# EAGLE design MAIN_BOT_P (EAGLE 9.4.2)
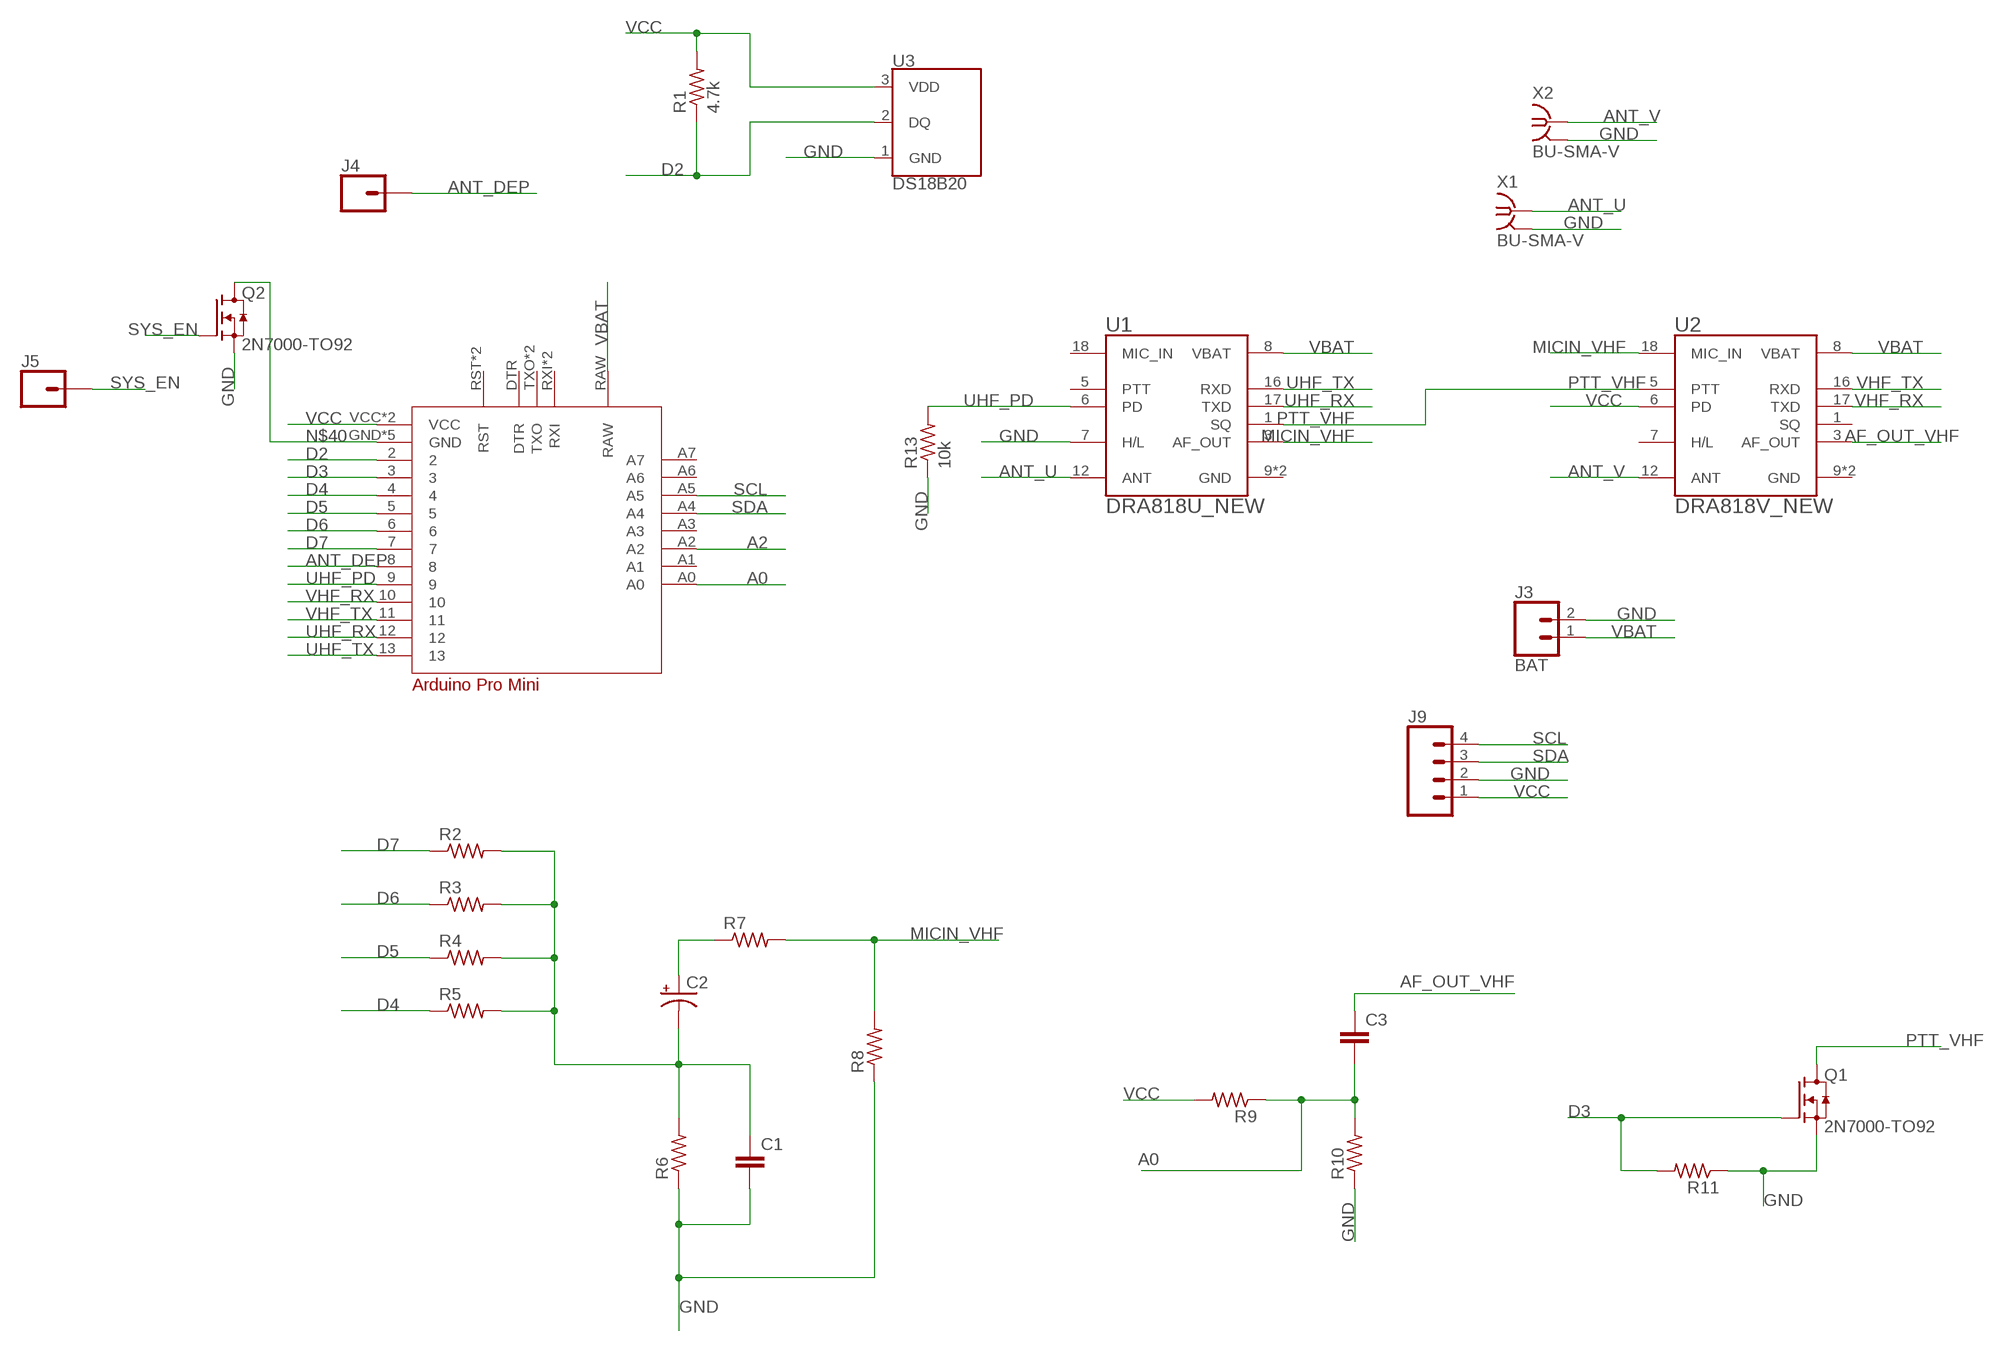
[diagram p0: schematic, sheet 1]

## Parts
C1  C-EU025-024X044  [C025-024X044]
C2  CPOL-USE1.8-4  [E1,8-4]
C3  C-EU025-024X044  [C025-024X044]
J3  BAT  CONN_02  [1X02]
J4  CONN_01  [1X01]
J5  CONN_01  [1X01]
J9  CONN_04PTH  [1X04]
Q1  2N7000-TO92  [TO92]
Q2  2N7000-TO92  [TO92]
R1  4.7k  R-US_0204/5  [0204/5]
R2  R-US_0204/5  [0204/5]
R3  R-US_0204/5  [0204/5]
R4  R-US_0204/5  [0204/5]
R5  R-US_0204/5  [0204/5]
R6  R-US_0204/5  [0204/5]
R7  R-US_0204/5  [0204/5]
R8  R-US_0204/5  [0204/5]
R9  R-US_0204/5  [0204/5]
R10  R-US_0204/5  [0204/5]
R11  R-US_0204/5  [0204/5]
R13  10k  R-US_0204/5  [0204/5]
U1  DRA818U_NEW  [DORJI_DRA818U_NEW]
U2  DRA818V_NEW  [DORJI_DRA818V_NEW]
U3  DS18B20  [TO-92-AMMO]
U$1  ARDUNIO_PRO_MINI  [ARDUINOPROMINI]
X1  BU-SMA-V  [BU-SMA-V]
X2  BU-SMA-V  [BU-SMA-V]

## Nets
A0: C3.2 R9.1 R10.2 U$1.A0
A2: U$1.A2
AF_OUT_VHF: C3.1 U2.3(AF_OUT)
ANT_DEP: J4.1 U$1.8
ANT_U: U1.12(ANT) X1.1
ANT_V: U2.12(ANT) X2.1
D2: R1.1 U3.2(DQ) U$1.2
D3: Q1.2(G) R11.2 U$1.3
D4: R5.1 U$1.4
D5: R4.1 U$1.5
D6: R3.1 U$1.6
D7: R2.1 U$1.7
GND: C1.2 J3.2 J9.2 Q1.3(S) Q2.3(S) R6.1 R8.1 R10.1 R11.1 R13.1 U1.7(H/L) U3.1(GND) X1.2 X1.3 X1.4 X1.5 X2.2 X2.3 X2.4 X2.5
MICIN_VHF: R7.2 R8.2 U1.3(AF_OUT) U2.18(MIC_IN)
N$2: C2.+ R7.1
N$3: C1.1 C2.- R2.2 R3.2 R4.2 R5.2 R6.2
N$40: Q2.1(D) U$1.GND U$1.GND2(GND) U$1.GND3(GND) U$1.GND4(GND) U$1.GND5(GND)
PTT_VHF: Q1.1(D) U1.1(SQ) U2.5(PTT)
SCL: J9.4 U$1.A5
SDA: J9.3 U$1.A4
SYS_EN: J5.1 Q2.2(G)
UHF_PD: R13.2 U1.6(PD) U$1.9
UHF_RX: U1.17(TXD) U$1.12
UHF_TX: U1.16(RXD) U$1.13
VBAT: J3.1 U1.8(VBAT) U2.8(VBAT) U$1.RAW
VCC: J9.1 R1.2 R9.2 U2.6(PD) U3.3(VDD) U$1.VCC U$1.VCC1(VCC)
VHF_RX: U2.17(TXD) U$1.10
VHF_TX: U2.16(RXD) U$1.11
Unconnected: U1.5(PTT) U1.18(MIC_IN) U2.1(SQ) U2.7(H/L) U$1.A1 U$1.A3 U$1.A6 U$1.A7 U$1.DTR U$1.RST U$1.RST1(RST) U$1.RXI U$1.RXI1(RXI) U$1.TXO U$1.TXO1(TXO)

## Power pins joined to a net without a drawn wire
GND: U1.9(GND) U1.10(GND) U2.9(GND) U2.10(GND)

## Library data of the parts
C1 C3 = rcl:C-EU: CAPACITOR, European symbol; SPICEPREFIX: C
C2 = rcl:CPOL-US: POLARIZED CAPACITOR, American symbol; SPICEPREFIX: C
J3 = SparkFun-Connectors:CONN_02: Multi connection point. Often used as Generic Header-pin footprint for 0.1 inch spaced/style header connections On any of the 0.1 inch spaced packages, you can populate with these: Break Away Headers - Straight <https://www.sparkfun.com/products/116> (PRT-00116) Break Away Male Headers - Right Angle <https://www.sparkfun.com/products/553> (PRT-00553) Female Headers <https://www.sparkfun.com/products/115> (PRT-00115) Break Away Headers - Machine Pin <https://www.sparkfun.com/products/117> (PRT-00117) Break Away Female Headers - Swiss Machine Pin <https://www.sparkfun.com/products/743> (PRT-00743) For SCREWTERMINALS and SPRING TERMINALS visit here: Screw Terimnals on SparkFun.com <https://www.sparkfun.com/search/results?term=Screw+Terminals> (5mm/3.5mm/2.54mm spacing) This device is also useful as a general connection point to wire up your design to another part of your project. Our various solder wires solder well into these plated through hole pads. Hook-Up Wire - Assortment (Stranded, 22 AWG) <https://www.sparkfun.com/products/11375> (PRT-11375) Hook-Up Wire - Assortment (Solid Core, 22 AWG) <https://www.sparkfun.com/products/11367> (PRT-11367) View the entire wire category on our website here <https://www.sparkfun.com/categories/141> Special notes: Molex polarized connector foot print use with: PRT-08233 with associated crimp pins and housings. 2.54_SCREWTERM for use with PRT-10571. 3.5mm Screw Terminal footprints for PRT-08084 5mm Screw Terminal footprints for use with PRT-08432
J4 J5 = SparkFun-Connectors:CONN_01: Single connection point. Often used as Generic Header-pin footprint for 0.1 inch spaced/style header connections On any of the 0.1 inch spaced packages, you can populate with these: Break Away Headers - Straight <https://www.sparkfun.com/products/116> (PRT-00116) Break Away Male Headers - Right Angle <https://www.sparkfun.com/products/553> (PRT-00553) Female Headers <https://www.sparkfun.com/products/115> (PRT-00115) Break Away Headers - Machine Pin <https://www.sparkfun.com/products/117> (PRT-00117) Break Away Female Headers - Swiss Machine Pin <https://www.sparkfun.com/products/743> (PRT-00743) This device is also useful as a general connection point to wire up your design to another part of your project. Our various solder wires solder well into these plated through hole pads. Hook-Up Wire - Assortment (Stranded, 22 AWG) <https://www.sparkfun.com/products/11375> (PRT-11375) Hook-Up Wire - Assortment (Solid Core, 22 AWG) <https://www.sparkfun.com/products/11367> (PRT-11367) View the entire wire category on our website here <https://www.sparkfun.com/categories/141> Special notes: SMTSO-256-ET is a "flush mount" nut for a 4-40 screw. We mostly use this on specialty testbeds; it is a nice way to connect hardware to your PCB at an adjustable hieght. Also note, the SNAP packages are for using a snappable style connector. We sell a baggie of snaps and they are also used on two LilyPad designs: Snap Assortment - 30 pack (male and female) <https://www.sparkfun.com/products/11347> (DEV-11347) LilyPad Arduino SimpleSnap <https://www.sparkfun.com/products/10941> (DEV-10941) LilyPad SimpleSnap Protoboard <https://www.sparkfun.com/products/10940> (DEV-10940)
J9 = SparkFun-Connectors:CONN_04: Multi connection point. Often used as Generic Header-pin footprint for 0.1 inch spaced/style header connections On any of the 0.1 inch spaced packages, you can populate with these: Break Away Headers - Straight <https://www.sparkfun.com/products/116> (PRT-00116) Break Away Male Headers - Right Angle <https://www.sparkfun.com/products/553> (PRT-00553) Female Headers <https://www.sparkfun.com/products/115> (PRT-00115) Break Away Headers - Machine Pin <https://www.sparkfun.com/products/117> (PRT-00117) Break Away Female Headers - Swiss Machine Pin <https://www.sparkfun.com/products/743> (PRT-00743) For SCREWTERMINALS and SPRING TERMINALS visit here: Screw Terimnals on SparkFun.com <https://www.sparkfun.com/search/results?term=Screw+Terminals> (5mm/3.5mm/2.54mm spacing) This device is also useful as a general connection point to wire up your design to another part of your project. Our various solder wires solder well into these plated through hole pads. Hook-Up Wire - Assortment (Stranded, 22 AWG) <https://www.sparkfun.com/products/11375> (PRT-11375) Hook-Up Wire - Assortment (Solid Core, 22 AWG) <https://www.sparkfun.com/products/11367> (PRT-11367) View the entire wire category on our website here <https://www.sparkfun.com/categories/141> Special notes: Molex polarized connector foot print use with SKU : PRT-08231 with associated crimp pins and housings. 1MM SMD Version SKU: PRT-10208; PROD_ID: CONN-09696
Q1 Q2 = 2N7000:2N7000: N-Channel Junction FET Check prices <https://pricing.snapeda.com/parts/2N7000/STMicroelectronics/view-part?ref=eda>; AVAILABILITY: Good; DESCRIPTION: N-Channel 60V 350mA (Tc) 1W (Tc) Through Hole TO-92-3; MF: STMicroelectronics; MP: 2N7000; PACKAGE: E-PKG AXIAL-LEADED-2 ON Semiconductor; PRICE: None; PURCHASE-URL: https://pricing.snapeda.com/search/part/2N7000/?ref=eda
R1-R11 R13 = rcl:R-US_: RESISTOR, American symbol; SPICEPREFIX: R
U1 = DRA818U_New:DRA818U_NEW: VHF Band Voice Transceiver Module; AVAILABILITY: Unavailable; MF: DORJI; MP: DRA818V; PACKAGE: Package Analog Devices; PRICE: None
U2 = DRA818V_new:DRA818V_NEW: VHF Band Voice Transceiver Module; AVAILABILITY: Unavailable; MF: DORJI; MP: DRA818V; PACKAGE: Package Analog Devices; PRICE: None
U3 = SparkFun-Sensors:DS18B20: Dallas/Maxim DS18B20 1-Wire Temperature Sensor The DS18B20 reports degrees C with 9 to 12-bit precision, -55C to 125C (+/-0.5C). Each sensor has a unique 64-Bit Serial number etched into it - allows for a huge number of sensors to be used on one data bus. Datasheet <http://datasheets.maximintegrated.com/en/ds/DS18B20.pdf> SparkFun Products One Wire Digital Temperature Sensor - DS18B20 <https://www.sparkfun.com/products/245> (SEN-00245); STORE_ID: SEN-00245
U$1 = Arduino_pro_mini:ARDUNIO_PRO_MINI
X1 X2 = con-coax:BU-SMA-V: FEMALE SMA CONNECTOR Radiall distributor RS 112-3794; OC_FARNELL: unknown; OC_NEWARK: unknown

## Net classes
1 vcc: width 0.254 mm

## Board
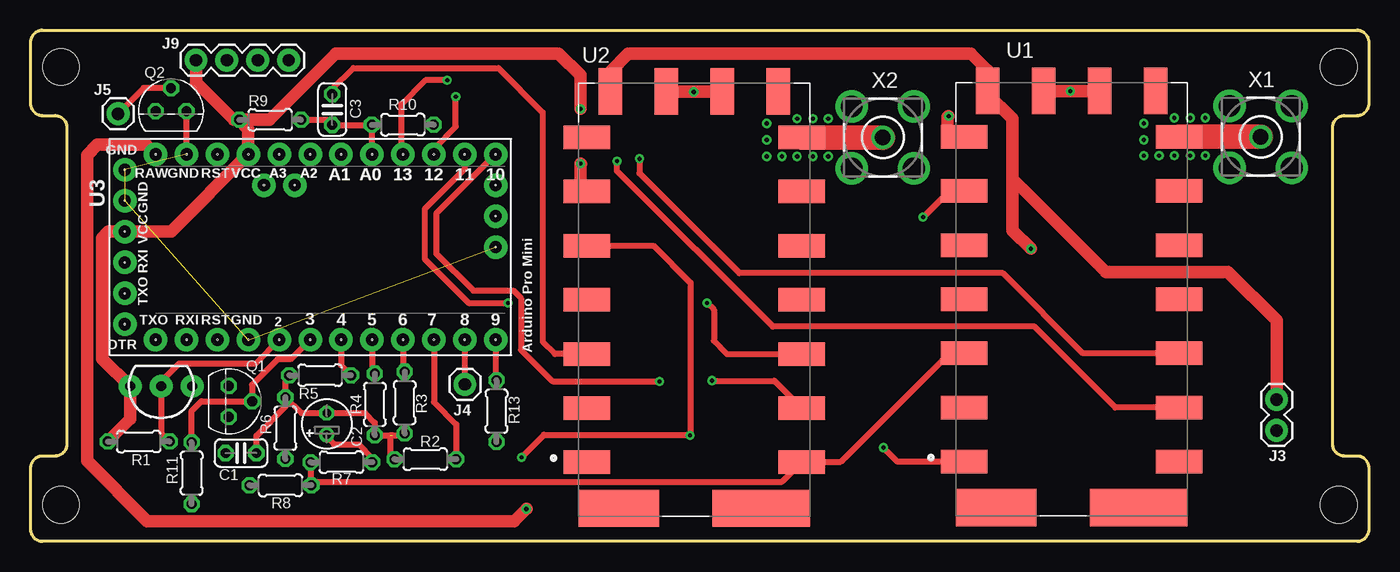
[diagram p1: board, top side]
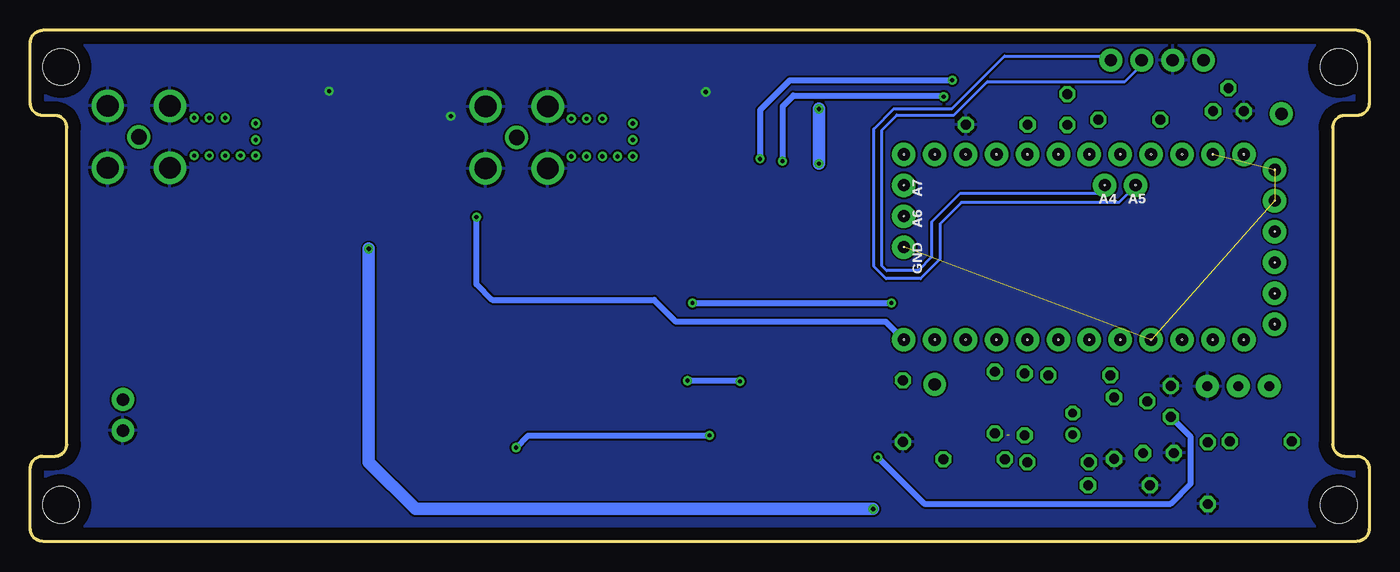
[diagram p2: board, bottom side, seen from below]

Size 110 x 42 mm. Coordinates in mm from the lower left corner, seen from the top.
Outline: 109,0 arc90 110,1 110,6 arc90 109,7 108,7 arc-90 107,8 107,34 arc-90 108,35 109,35 arc90 110,36 110,41 arc90 109,42 1,42 arc90 0,41 0,36 arc90 1,35 2,35 arc-90 3,34 3,8 arc-90 2,7 1,7 arc90 0,6 0,1 arc90 1,0 109,0
Copper layers (1*16): Top 0.035mm / dielectric 0.2mm / Bottom 0.035mm
Design rules "default *": minimum track width 6mil, minimum drill 0.35mm, track to track 6mil, track to pad 6mil, pad to pad 6mil, via to via 6mil, smd to smd 6mil, copper to edge 40mil, drill to drill 6mil, minimum pad ring 10mil, minimum via ring 8mil, stop-mask expansion 4mil, vias tented up to drill 0mil, thermal gap 10mil
Holes 3 mm at 2.5,39 2.5,3 107.5,3 107.5,39

### Footprints (pad centres in the part's own frame; a part is rotated, then mirrored left to right if it is on the bottom)
C025-024X044 = drill 0.813 octagon: 1 -1.27,0; 2 1.27,0
E1,8-4 = drill 0.711 pad 1.168: + -0.889,0 | drill 0.711 pad 1.168 octagon: - 0.889,0
1X02 = drill 1.016 pad 1.88: 1 0,0; 2 2.54,0
1X01 = drill 1.016 pad 1.88: 1 0,0
1X04 = drill 1.016 pad 1.88: 1 0,0; 2 2.54,0; 3 5.08,0; 4 7.62,0
TO92 = drill 0.813 octagon: 1 1.27,0; 2 0,1.905; 3 -1.27,0
0204/5 = drill 0.813 octagon: 1 -2.54,0; 2 2.54,0
DORJI_DRA818U_NEW = smd 1.93 x 3.81: 1 -13.35,8.825; 2 -8.9,8.825; 3 -4.45,8.825; 4 0,8.825; 5 4.45,8.825; 6 8.9,8.825; 7 13.35,8.825; 12 13.35,-8.825; 13 8.9,-8.825; 14 4.45,-8.825; 15 0,-8.825; 16 -4.45,-8.825; 17 -8.9,-8.825; 18 -13.35,-8.825 | smd 3.81 x 1.93: 8 17.125,6.9; 9 17.125,2.3; 10 17.125,-2.3; 11 17.125,-6.9 | smd 3.048 x 6.6: P2 -17.125,6.2 | smd 3.048 x 8: P3 -17.125,-5.5
DORJI_DRA818V_NEW = smd 1.93 x 3.81: 1 -13.35,8.825; 2 -8.9,8.825; 3 -4.45,8.825; 4 0,8.825; 5 4.45,8.825; 6 8.9,8.825; 7 13.35,8.825; 12 13.35,-8.825; 13 8.9,-8.825; 14 4.45,-8.825; 15 0,-8.825; 16 -4.45,-8.825; 17 -8.9,-8.825; 18 -13.35,-8.825 | smd 3.81 x 1.93: 8 17.125,6.9; 9 17.125,2.3; 10 17.125,-2.3; 11 17.125,-6.9 | smd 3.048 x 6.6: P2 -17.125,6.2 | smd 3.048 x 8: P3 -17.125,-5.5
TO-92-AMMO = drill 0.813 pad 1.88: 1 -2.54,0; 2 0,0; 3 2.54,0
ARDUINOPROMINI = drill 1 pad 1.93: 2 1.27,19.05; 3 1.27,16.51; 4 1.27,13.97; 5 1.27,11.43; 6 1.27,8.89; 7 1.27,6.35; 8 1.27,3.81; 9 1.27,1.27; 10 16.51,1.27; 11 16.51,3.81; 12 16.51,6.35; 13 16.51,8.89; A0 16.51,11.43; A1 16.51,13.97; A2 16.51,16.51; A3 16.51,19.05; A4 13.97,17.78; A5 13.97,20.32; A6 11.43,1.27; A7 13.97,1.27; DTR 2.54,31.75; GND 1.27,21.59; GND2 12.7,31.75; GND3 15.24,31.75; GND4 16.51,26.67; GND5 8.89,1.27; RAW 16.51,29.21; RST 1.27,24.13; RST1 16.51,24.13; RXI 1.27,26.67; RXI1 7.62,31.75; TXO 1.27,29.21; TXO1 5.08,31.75; VCC 10.16,31.75; VCC1 16.51,21.59 | hole 0.076: 1.27,1.27; 1.27,3.81; 1.27,6.35; 1.27,8.89; 1.27,11.43; 1.27,13.97; 1.27,16.51; 1.27,19.05; 1.27,21.59; 1.27,24.13; 1.27,26.67; 1.27,29.21; 2.54,31.75; 5.08,31.75; 7.62,31.75; 10.16,31.75; 12.7,31.75; 15.24,31.75; 16.51,29.21; 16.51,26.67; 16.51,24.13; 16.51,21.59; 16.51,19.05; 16.51,16.51; 16.51,13.97; 16.51,11.43; 16.51,8.89; 16.51,6.35; 16.51,3.81; 16.51,1.27; 13.97,20.32; 13.97,17.78; 11.43,1.27; 13.97,1.27; 8.89,1.27
BU-SMA-V = drill 1.27: 1 0,0 | drill 1.778: 2 -2.55,2.55; 3 2.55,2.55; 4 2.55,-2.55; 5 -2.55,-2.55

### Placement (x,y rotation side)
C1  17.3,7.25 180 top
C2  24.35,9.65 90 top
C3  24.8,35.5 270 top
J3  102.4,11.65 270 top
J4  35.7,12.9 0 top
J5  7.2,35.15 0 top
J9  13.6,39.55 0 top
Q1  16.3,11.5 270 top
Q2  11.55,35.35 0 top
R1  8.9,8.2 180 top
R2  32.45,6.75 180 top
R3  30.75,11.4 270 top
R4  28.3,11.25 270 top
R5  23.8,13.65 180 top
R6  20.95,9.3 90 top
R7  25.55,6.5 180 top
R8  20.55,4.6 0 top
R9  19.7,34.65 180 top
R10  30.6,34.25 180 top
R11  13.25,5.6 90 top
R13  38.3,10.7 90 top
U1  85.55,19.9 90 top
U2  54.55,19.85 90 top
U3  10.75,12.75 180 top
U$1  39.5,15.3 90 top
X1  101.1,33.25 0 top
X2  70.05,33.2 0 top

### Tracks (layer width: path | path; a pad name or v marks a point on that pad's centre or on a via)
A0
  Top 0.508: U$1.A0 R10.2 | R10.2 27.91,34.4 | R9.1 24.38,34.65 C3.2 28.04,34.23 R10.2
AF_OUT_VHF
  Top 0.508: U2.3 43.1,15.4 42.1,16.4 42.1,35.25 38.45,38.9 26.55,38.9 24.8,37.15 C3.1
ANT_DEP
  Top 0.508: U$1.8 J4.1
ANT_U
  Top 2: U1.12 X1.1
ANT_V
  Top 2: U2.12 X2.1
D2
  Top 0.508: U3.2 10.75,13.15 12.2,14.6 18.5,14.6 20.45,16.55 U$1.2 | 10.72,12.72 U3.2 | U3.2 10.75,8.89 R1.1
D3
  Top 0.508: 22.99,16.54 U$1.3 21.37,14.95 20.3,14.95 18.2,12.86 Q1.2 14.05,11.5 13.25,10.7 R11.2
D4
  Top 0.508: U$1.4 25.53,14.47 R5.1
D5
  Top 0.508: 28.1,16.54 U$1.5 28.07,14.02 R4.1
D6
  Top 0.508: U$1.6 30.61,14.08 R3.1
D7
  Top 0.508: U$1.7 33.15,11.45 34.99,9.61 R2.1
GND  (via drill 0.35)
  Top 0.508: U2.9 52.25,36.38 | U2.10 56.85,36.33 | U1.10 87.85,36.38 | U1.7 75.97,33.25 75.35,33.88
  Top 1.016: U2.9 54.48,36.98 | 54.48,36.98 v54.5,36.95 | U2.10 54.48,36.98 | U1.9 85.42,37.02 | 85.42,37.02 v85.45,37 | U1.10 85.42,37.02 | 75.35,33.88 75.35,34.85 v75.45,34.95
  pour Bottom: 0.05,41.4 0.65,42 109.35,42 110,41.35 110,0.65 109.3,-0.05 0.7,-0.05 0.05,0.6
MICIN_VHF
  Top 0.508: U1.3 75.5,15.45 66.6,6.55 63.42,6.55 U2.18 61.77,4.9 23.4,4.9 R8.2 23.01,4.68 R7.2
N$1  (via drill 0.35)
  other vias: 65.55,34.75
N$2
  Top 0.508: C2.+ 24.35,8.55 24.95,7.95 27,7.95 28.09,6.86 R7.1
N$3  (1 unrouted)
  Top 0.508: C2.- 24.36,10.55 | R6.2 22.25,10.54 C2.- | R5.2 21.21,13.65 20.95,13.39 R6.2 | C1.1 18.57,8.67 20.95,11.05 R6.2 | C2.- 27.51,10.54 28.3,9.75 R4.2 29.56,8.71 29.56,7.1 R2.2 | 29.75,8.71 30.6,8.71 R3.2
N$4  (via drill 0.35)
  other vias: 64.3,34.75
N$5  (via drill 0.35)
  other vias: 63,34.75
N$6  (via drill 0.35)
  other vias: 65.55,31.65
N$7  (via drill 0.35)
  other vias: 64.3,31.65
N$8  (via drill 0.35)
  other vias: 63,31.65
N$9  (via drill 0.35)
  other vias: 60.5,34.35
N$10  (via drill 0.35)
  other vias: 60.5,33
N$11  (via drill 0.35)
  other vias: 61.75,31.65
N$12  (via drill 0.35)
  other vias: 60.5,31.65
N$13  (via drill 0.35)
  other vias: 96.55,34.8
N$14  (via drill 0.35)
  other vias: 95.3,34.8
N$15  (via drill 0.35)
  other vias: 94,34.8
N$16  (via drill 0.35)
  other vias: 91.5,34.35
N$17  (via drill 0.35)
  other vias: 91.5,33
N$18  (via drill 0.35)
  other vias: 96.55,31.7
N$19  (via drill 0.35)
  other vias: 95.3,31.7
N$20  (via drill 0.35)
  other vias: 94,31.7
N$21  (via drill 0.35)
  other vias: 92.75,31.7
N$22  (via drill 0.35)
  other vias: 91.5,31.7
N$40  (4 unrouted)
  Top 0.508: U$1.GND4 Q2.1
PTT_VHF  (via drill 0.35)
  Top 0.508: U1.1 71.25,6.55 v70.1,7.7 | U2.5 51.2,24.3 54.25,21.25 54.25,8.75 | 54.25,8.75 v54.2,8.7 | 54.25,8.75 42.2,8.75 v40.35,6.9
  Bottom 0.508: Q1.1 14.65,8.58 14.65,4.75 16.3,3.1 36.55,3.1 v40.35,6.9 | v70.1,7.7 69.1,8.7 v54.2,8.7
SCL
  Bottom 0.254: U$1.A5 19.18,29.22 20.55,27.85 33.5,27.85 35.25,26.1 35.25,23.2 36.85,21.6 39.7,21.6 40.7,22.6 40.7,33.9 39.05,35.55 34.3,35.55 29.95,39.9 21.57,39.9 J9.4
SDA
  Bottom 0.254: U$1.A4 22.37,28.62 33.58,28.62 35.95,26.25 35.95,23.35 37.05,22.25 39.65,22.25 40.05,22.65 40.05,33.8 38.8,35.05 34.1,35.05 31.35,37.8 20.05,37.8 18.68,39.17 J9.3
SYS_EN
  Top 0.508: Q2.2 9.3,37.26 J5.1
UHF_PD  (via drill 0.35)
  Top 0.508: v73.35,26.65 73.38,26.65 75.53,28.8 U1.6 | U$1.9 38.23,13.31 R13.2
  Bottom 0.508: U$1.9 39.71,18.05 56.95,18.05 58.75,19.85 72.05,19.85 73.35,21.15 v73.35,26.65
UHF_RX  (via drill 0.35)
  Top 0.508: U1.17 89.15,11 82.5,17.65 61,17.65 48.2,30.45 v48.2,31.25 | U$1.12 33.15,32.3 34.95,34.1 v34.95,36.55
  Bottom 0.508: v34.95,36.55 35.05,36.65 47.3,36.65 48.2,35.75 v48.2,31.25
UHF_TX  (via drill 0.35)
  Top 0.508: U1.16 86.5,15.45 79.9,22.05 58.25,22.05 50.05,30.25 v50.05,31.45 | v34.25,37.9 32.45,37.9 30.5,35.95 30.5,31.92 U$1.13
  Bottom 0.508: v34.25,37.9 47.6,37.9 50.05,35.45 v50.05,31.45
VBAT  (via drill 0.35)
  Top 1.016: 80.7,29.8 88.35,22.15 98.4,22.15 102.4,18.15 J3.1 | 80.7,29.8 80.7,34.73 78.65,36.77 U1.8 78.65,38.72 77.28,40.09 49.12,40.09 47.65,38.62 U2.8 | 80.7,29.8 80.7,25.55 v82.2,24.05 | U$1.RAW 9.5,32.6 5.5,32.6 4.65,31.75 4.65,6.6 9.6,1.65 39.75,1.65 v40.75,2.65
  Bottom 1.016: v82.2,24.05 82.2,6.5 78.35,2.65 v40.75,2.65
VCC  (via drill 0.35)
  Top 1.016: J9.1 13.6,37.75 16.7,34.65 R9.2 | v45.2,35.55 45.2,38.3 43.4,40.1 25.1,40.1 19.65,34.65 R9.2 | 45.23,31.02 v45.2,31.05 45.2,29.27 U2.6 | R1.2 8.21,10.05 U3.3 8.18,12.72 5.9,15 5.9,24.95 6.41,25.46 U$1.VCC 11.56,25.46 U$1.VCC1 17.91,33.9 R9.2
  Bottom 1.016: v45.2,35.55 v45.2,31.05
VHF_RX  (via drill 0.35)
  Top 0.508: U$1.10 33.35,26.93 33.35,23.65 36.4,20.6 39.7,20.6 40.3,20 40.3,15.75 42.9,13.15 v51.7,13.15 | v56,13.2 61.12,13.2 U2.17
  Bottom 0.508: v51.7,13.15 51.75,13.2 v56,13.2
VHF_TX  (via drill 0.35)
  Top 0.508: U$1.11 35.69,30.61 32.4,27.32 32.4,23.2 36,19.6 v39.25,19.6 | v55.6,19.6 56.15,19.05 56.15,16.5 57.25,15.4 U2.16
  Bottom 0.508: v55.6,19.6 v39.25,19.6